# EAGLE design shield31 (EAGLE 5.02)
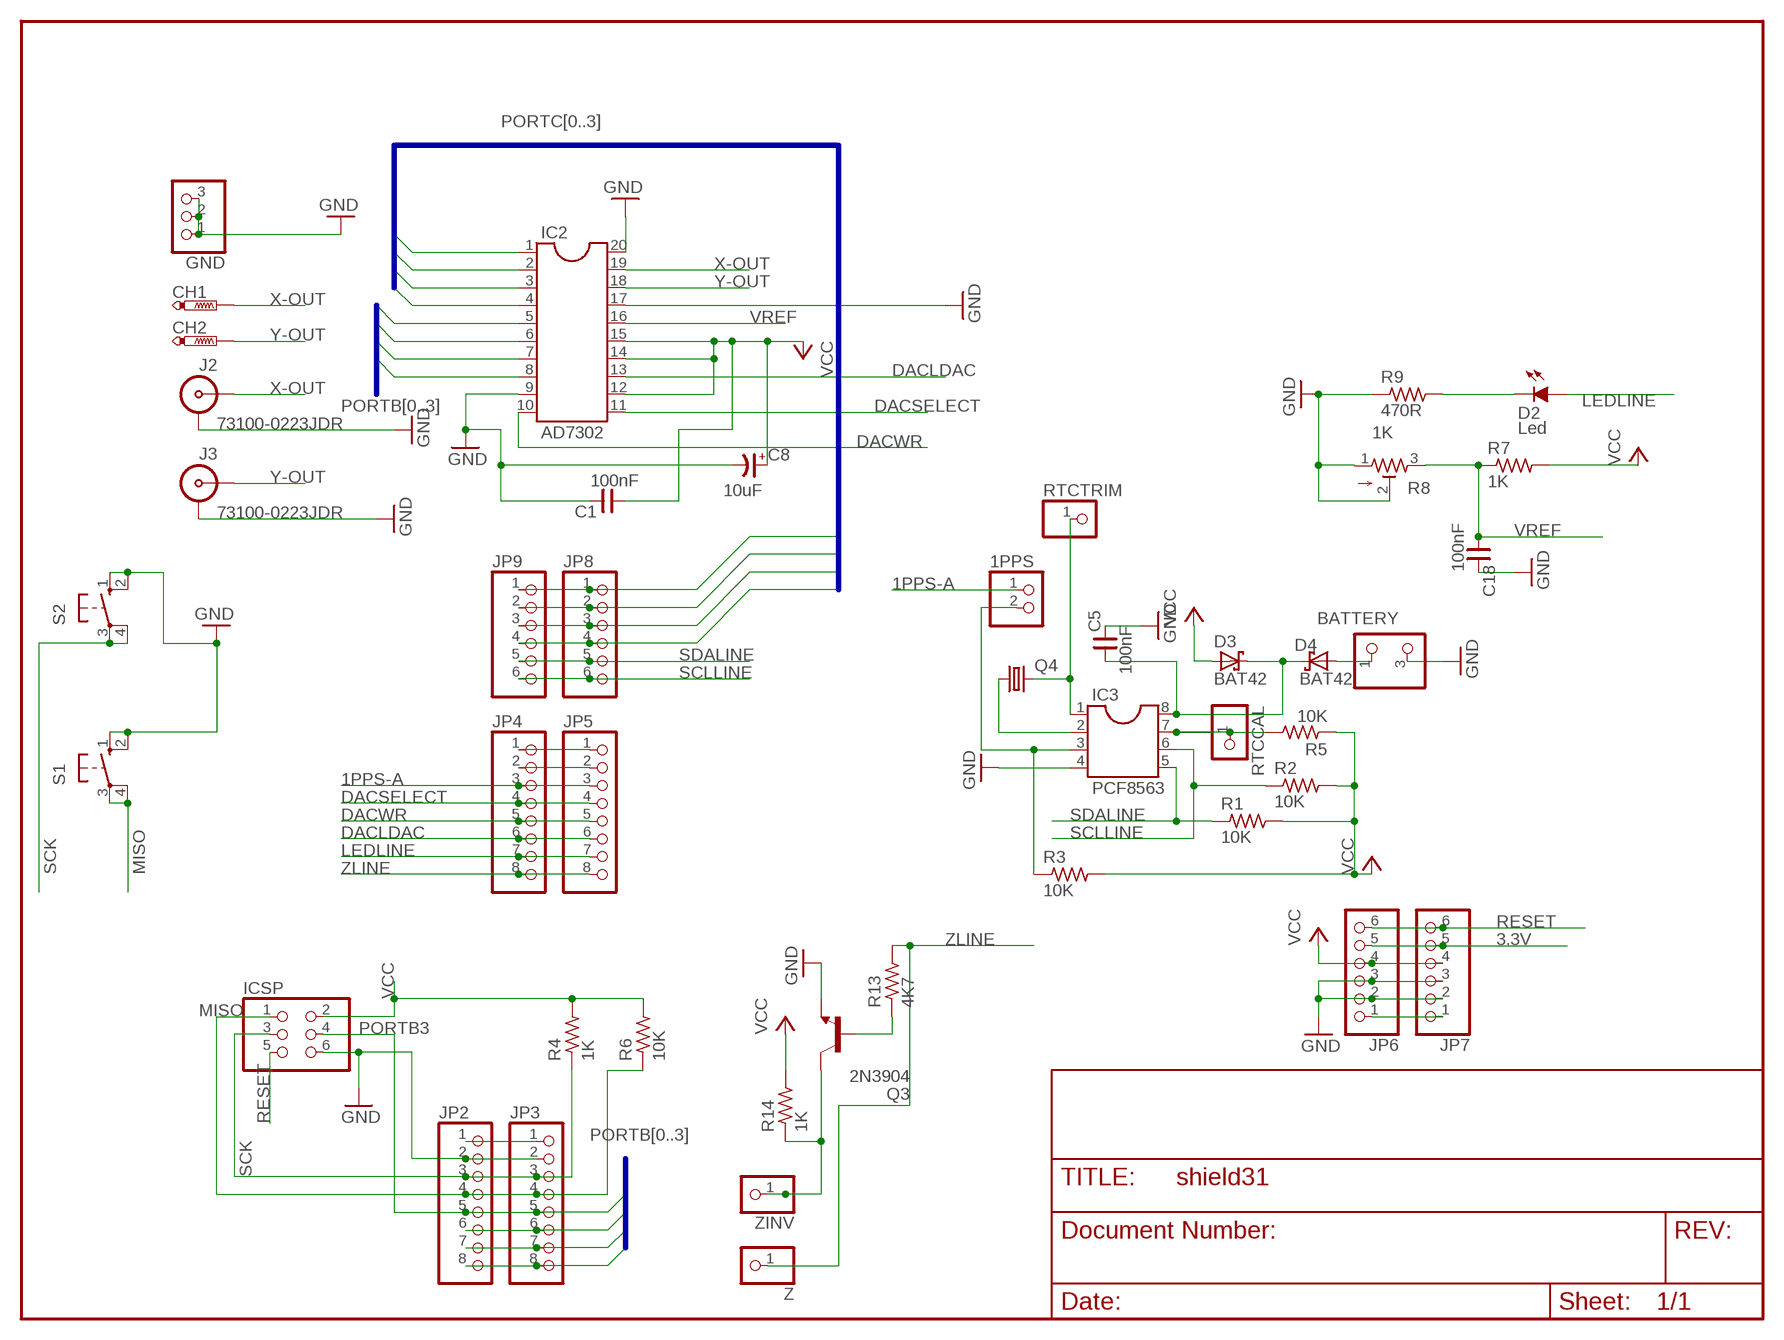
[diagram p0: schematic, sheet 1]

## Parts
1PPS  PINHD-1X2  [1X02]
BATTERY  PINHD-1X3BAT  [1X03BAT]
C1  100nF  C-EU025-025X050  [C025-025X050]
C5  100nF  C-EU025-025X050  [C025-025X050]
C8  10uF  CPOL-USE2.5-5  [E2,5-5]
C18  100nF  C-EU025-025X050  [C025-025X050]
CH1  PTR1PAD1-20Y  [P1-20Y]
CH2  PTR1PAD1-20Y  [P1-20Y]
D2  Led  LED3MM  [LED3MM]
D3  BAT42  SCHOTTKY-DIODEDO35-7  [DO35-7]
D4  BAT42  SCHOTTKY-DIODEDO35-7  [DO35-7]
GND  PINHD-1X3  [1X03]
IC2  AD7302  DIL20  [DIL20]
IC3  PCF8563  DIL8  [DIL08]
ICSP  PINHD-2X3  [2X03]
J2  73100-0223JDR  [73100-0223JDR]
J3  73100-0223JDR  [73100-0223JDR]
JP2  PINHD-1X8B  [1X08-BIG]
JP3  PINHD-1X8CLEANBIG  [1X08-CLEANBIG]
JP4  PINHD-1X8B  [1X08-BIG]
JP5  PINHD-1X8CLEANBIG  [1X08-CLEANBIG]
JP6  PINHD-1X6CB  [1X06-CLEANBIG]
JP7  PINHD-1X6B  [1X06-BIG]
JP8  PINHD-1X6CB  [1X06-CLEANBIG]
JP9  PINHD-1X6B  [1X06-BIG]
Q3  2N3904  [TO92]
Q4  CRYSTALTC26H  [TC26H]
R1  10K  R-EU_0207/10  [0207/10]
R2  10K  R-EU_0207/10  [0207/10]
R3  10K  R-EU_0207/10  [0207/10]
R4  1K  R-EU_0207/10  [0207/10]
R5  10K  R-EU_0207/10  [0207/10]
R6  10K  R-EU_0207/10  [0207/10]
R7  1K  R-EU_0207/10  [0207/10]
R8  1K  PIHER-POTV-PT10  [PT-10VERT]
R9  470R  R-EU_0207/10  [0207/10]
R13  4K7  R-EU_0207/10  [0207/10]
R14  1K  R-EU_0207/10  [0207/10]
RTCCAL  PINHD-1X1  [1X01]
RTCTRIM  PINHD-1X1  [1X01]
S1  10-XX  [B3F-10XX]
S2  10-XX  [B3F-10XX]
Z  PINHD-1X1  [1X01]
ZINV  PINHD-1X1  [1X01]

## Nets
1PPS-A: 1PPS.1 JP4.3 JP5.3
1PPS-B: 1PPS.2 IC3.3 R3.1
3.3V: JP6.5 JP7.5
BATPOWER: BATTERY.1 D4.A
DACLDAC: IC2.13 JP4.6 JP5.6
DACSELECT: IC2.11 JP4.4 JP5.4
DACWR: IC2.10 JP4.5 JP5.5
GND: BATTERY.3 C1.1 C5.1 C8.- C18.1 GND.1 GND.2 GND.3 IC2.9 IC2.17 IC2.20 IC3.4 ICSP.6 J2.GND J3.GND JP2.2 JP3.2 JP6.2 JP6.3 JP7.2 JP7.3 Q3.3(E) R8.1 R8.2 R9.1 S1.1(S) S1.2(S1) S2.1(S) S2.2(S1)
LEDLINE: D2.A JP4.7 JP5.7
MISO: ICSP.1 JP2.4 JP3.4 R6.1 S1.3(P) S1.4(P1)
N$1: IC3.7 R5.2 RTCCAL.1
N$2: JP2.1 JP3.1
N$3: D2.K(C) R9.2
N$13: IC3.1 Q4.2 RTCTRIM.1
N$14: IC3.2 Q4.1
N$15: JP6.1 JP7.1
N$26: Q3.2(B) R13.1
N$185: JP4.1 JP5.1
N$186: JP4.2 JP5.2
PORTB0: IC2.8 JP2.8 JP3.8
PORTB1: IC2.7 JP2.7 JP3.7
PORTB2: IC2.6 JP2.6 JP3.6
PORTB3: IC2.5 ICSP.4 JP2.5 JP3.5
PORTC0: IC2.4 JP8.1 JP9.1
PORTC1: IC2.3 JP8.2 JP9.2
PORTC2: IC2.2 JP8.3 JP9.3
PORTC3: IC2.1 JP8.4 JP9.4
RESET: ICSP.5 JP6.6 JP7.6
RTCPOWER: C5.2 D3.C D4.C IC3.8
SCK: ICSP.3 JP2.3 JP3.3 R4.1 S2.3(P) S2.4(P1)
SCLLINE: IC3.6 JP8.6 JP9.6 R2.1
SDALINE: IC3.5 JP8.5 JP9.5 R1.1
VCC: C1.2 C8.+ D3.A IC2.12 IC2.14 IC2.15 ICSP.2 JP6.4 JP7.4 R1.2 R2.2 R3.2 R4.2 R5.1 R6.2 R7.2 R14.2
VREF: C18.2 IC2.16 R7.1 R8.3
X-OUT: CH1.1(TP) IC2.19 J2.P
Y-OUT: CH2.1(TP) IC2.18 J3.P
ZINVLINE: Q3.1(C) R14.1 ZINV.1
ZLINE: JP4.8 JP5.8 R13.2 Z.1

## Buses
PORTC[0..3]
PORTB[0..3]

## Library data of the parts
1PPS = pinhead:PINHD-1X2: PIN HEADER
BATTERY = pinhead:PINHD-1X3BAT
C1 C5 C18 = rcl:C-EU: CAPACITOR, European symbol
C8 = rcl:CPOL-US: POLARIZED CAPACITOR, American symbol
CH1 CH2 = testpad:PTR1: TEST PIN
D2 = led:LED: LED OSRAM: - CHIPLED LG R971, LG N971, LY N971, LG Q971, LY Q971, LO R971, LY R971 LH N974, LH R974 LS Q976, LO Q976, LY Q976 LO Q996 - Hyper CHIPLED LW Q18S LB Q993, LB Q99A, LB R99A - SideLED LS A670, LO A670, LY A670, LG A670, LP A670 LB A673, LV A673, LT A673, LW A673 LH A674 LY A675 LS A676, LA A676, LO A676, LY A676, LW A676 LS A679, LY A679, LG A679 - Hyper Micro SIDELED® LS Y876, LA Y876, LO Y876, LY Y876 LT Y87S - SmartLED LW L88C, LW L88S LB L89C, LB L89S, LG L890 LS L89K, LO L89K, LY L89K LS L896, LA L896, LO L896, LY L896 - TOPLED LS T670, LO T670, LY T670, LG T670, LP T670 LSG T670, LSP T670, LSY T670, LOP T670, LYG T670 LG T671, LOG T671, LSG T671 LB T673, LV T673, LT T673, LW T673 LH T674 LS T676, LA T676, LO T676, LY T676, LB T676, LH T676, LSB T676, LW T676 LB T67C, LV T67C, LT T67C, LS T67K, LO T67K, LY T67K, LW E67C LS E67B, LA E67B, LO E67B, LY E67B, LB E67C, LV E67C, LT E67C LW T67C LS T679, LY T679, LG T679 LS T770, LO T770, LY T770, LG T770, LP T770 LB T773, LV T773, LT T773, LW T773 LH T774 LS E675, LA E675, LY E675, LS T675 LS T776, LA T776, LO T776, LY T776, LB T776 LHGB T686 LT T68C, LB T68C - Hyper Mini TOPLED® LB M676 - Mini TOPLED Santana® LG M470 LS M47K, LO M47K, LY M47K Source: http://www.osram.convergy.de/
D3 D4 = diode:SCHOTTKY-DIODE: Schottky Diode
GND = pinhead:PINHD-1X3: PIN HEADER
IC2 = ic-package:DIL20: Dual In Line / Socket
IC3 = ic-package:DIL8: Dual In Line / Socket
ICSP = pinhead:PINHD-2X3: PIN HEADER
J2 J3 = con-coax:73100-0223: BNC CONNECTOR - Molex RF Connector, 50 ohm
JP2-JP5 = carduino:PINHD-1X8: PIN HEADER
JP6-JP9 = carduino:PINHD-1X6: PIN HEADER
Q3 = transistor-npn:2N3904: NPN Transistor
Q4 = crystal:CRYSTAL: CRYSTAL
R1-R7 R9 R13 R14 = rcl:R-EU_: RESISTOR, European symbol
R8 = Jdr-Eagle:PIHER-POTV-: Piher vertical pot h2.5
RTCCAL RTCTRIM Z ZINV = pinhead:PINHD-1X1: PIN HEADER
S1 S2 = switch-omron:10-XX: OMRON SWITCH

## Board
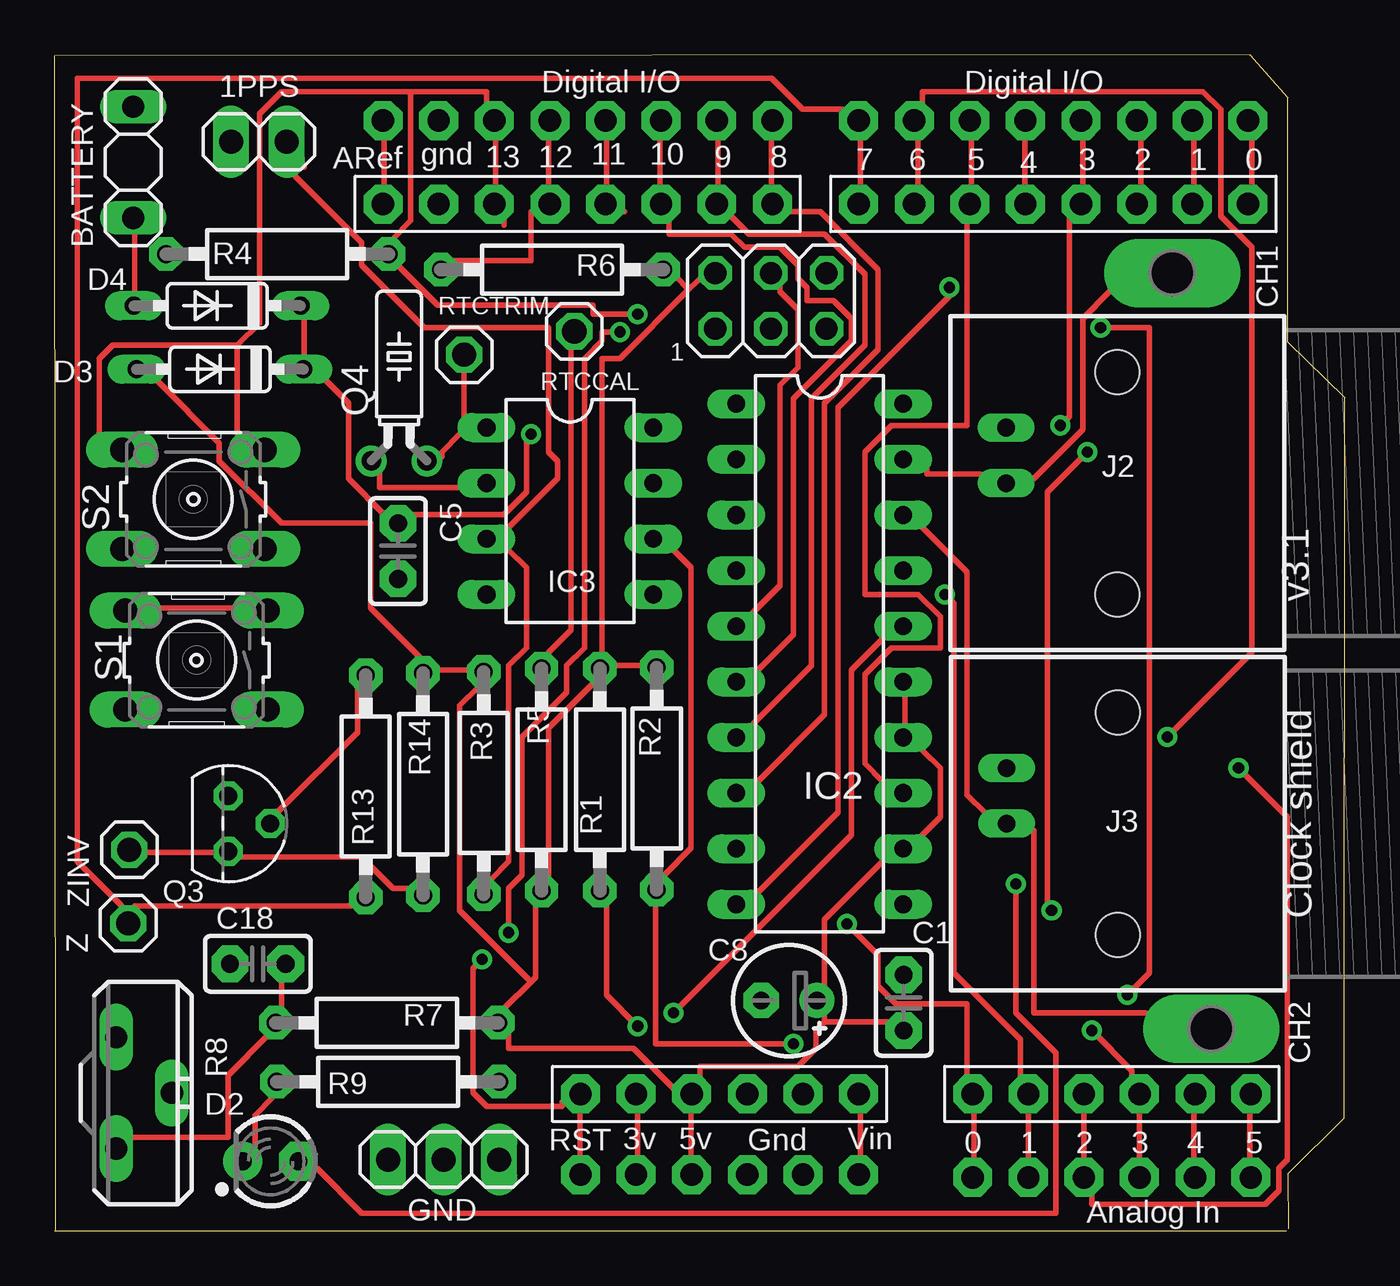
[diagram p1: board, top side]
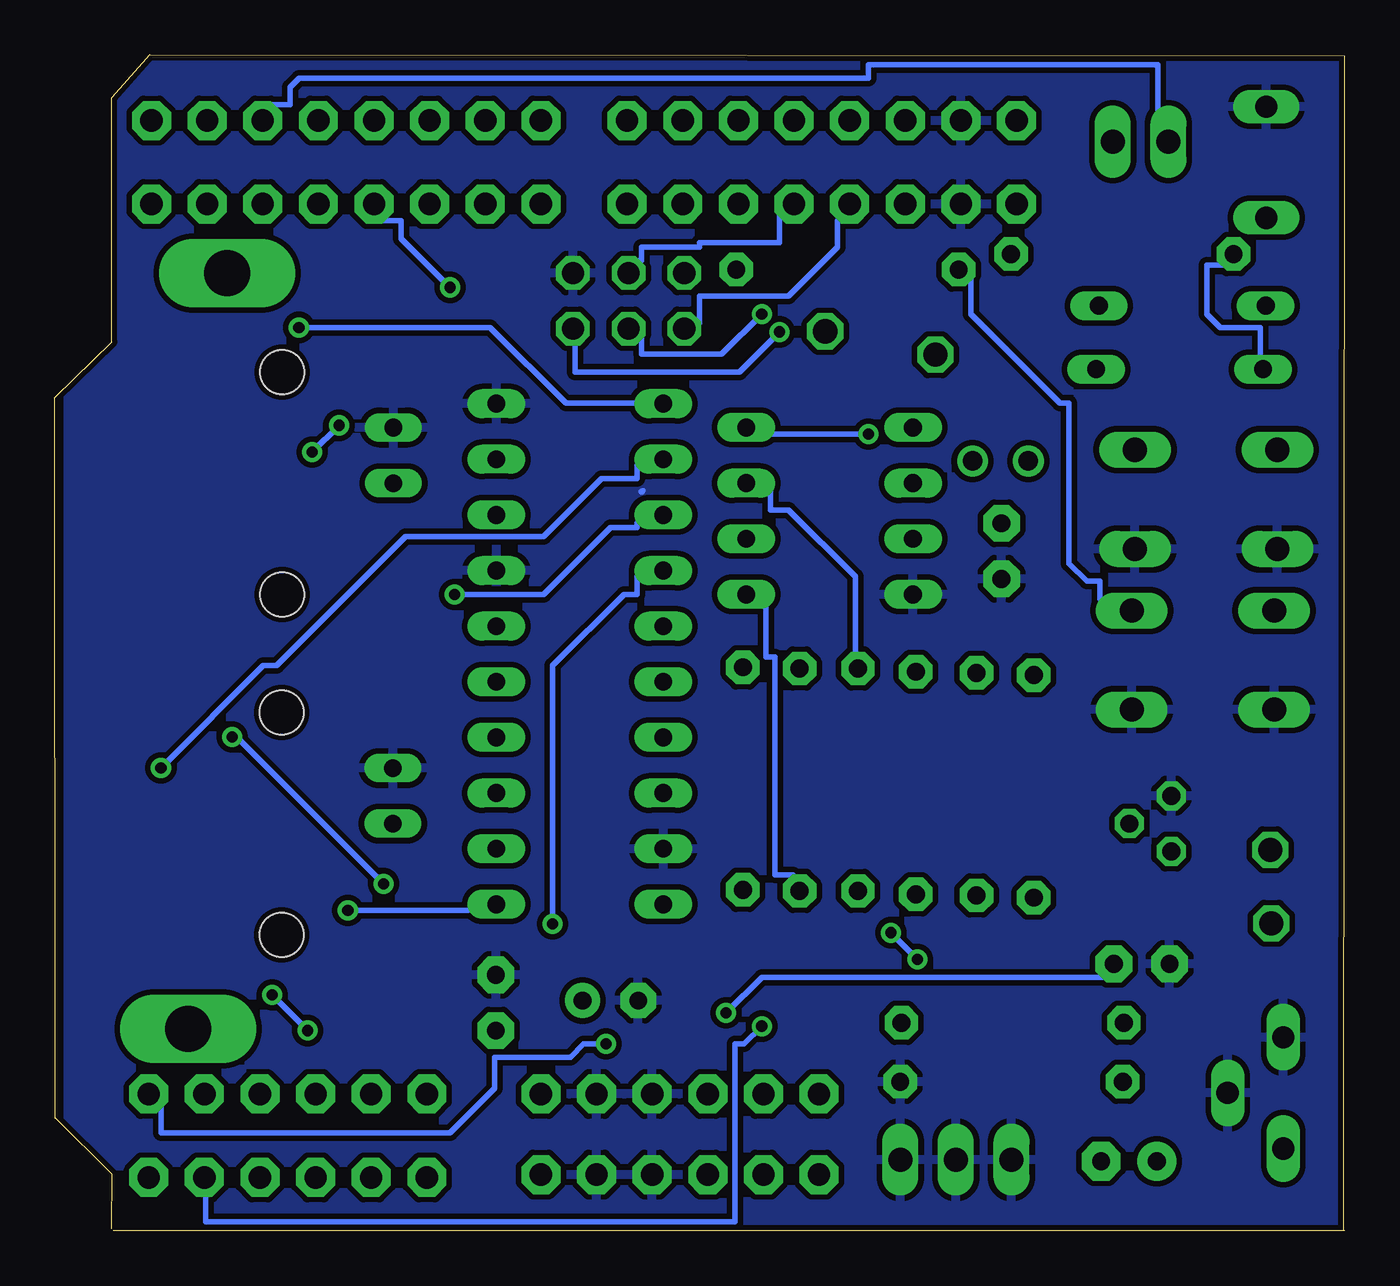
[diagram p2: board, bottom side, seen from below]

Size 58.9 x 53.71 mm. Coordinates in mm from the lower left corner, seen from the top.
Outline: 58.87,5.15 58.87,5.16
Outline: 58.87,5.16 58.9,38.05 56.3,40.59 56.3,51.73 54.57,53.71 0.01,53.66 0.05,0
Outline: 58.87,5.16 56.3,2.6 56.31,0.1
Outline: 0,0.01 56.24,0.01
Copper layers (1*16): Top 0.035mm / dielectric 1.5mm / Bottom 0.035mm
Design rules "default *": minimum track width 10mil, minimum drill 20mil, track to track 8mil, track to pad 8mil, pad to pad 8mil, via to via 8mil, smd to smd 8mil, copper to edge 10mil, drill to drill 8mil, minimum pad ring 10mil, minimum via ring 8mil, stop-mask expansion 4mil, vias tented up to drill 0mil, thermal gap 10mil

### Footprints (pad centres in the part's own frame; a part is rotated, then mirrored left to right if it is on the bottom)
1X02 = drill 1.1 long: 1 -1.27,0; 2 1.27,0
1X03BAT = drill 1.016 long: 1 -2.54,0; 3 2.54,0
C025-025X050 = drill 0.813 pad 1.676 octagon: 1 -1.27,0; 2 1.27,0
E2,5-5 = drill 0.813 pad 1.6 round: + -1.27,0 | drill 0.813 pad 1.6 octagon: - 1.27,0
P1-20Y = drill 2.1 pad 2.54 long: 1 0,0
LED3MM = drill 0.813 pad 1.778 octagon: A -1.27,0 | drill 0.813 pad 1.778 round: K 1.27,0
DO35-7 = drill 0.813 long: A 3.81,0; C -3.81,0
1X03 = drill 1.1 long: 1 -2.54,0; 2 0,0; 3 2.54,0
DIL20 = drill 0.813 long: 1 -11.43,-3.81; 2 -8.89,-3.81; 3 -6.35,-3.81; 4 -3.81,-3.81; 5 -1.27,-3.81; 6 1.27,-3.81; 7 3.81,-3.81; 8 6.35,-3.81; 9 8.89,-3.81; 10 11.43,-3.81; 11 11.43,3.81; 12 8.89,3.81; 13 6.35,3.81; 14 3.81,3.81; 15 1.27,3.81; 16 -1.27,3.81; 17 -3.81,3.81; 18 -6.35,3.81; 19 -8.89,3.81; 20 -11.43,3.81
DIL08 = drill 0.813 long: 1 -3.81,-3.81; 2 -1.27,-3.81; 3 1.27,-3.81; 4 3.81,-3.81; 5 3.81,3.81; 6 1.27,3.81; 7 -1.27,3.81; 8 -3.81,3.81
2X03 = drill 1.016 octagon: 1 -2.54,-1.27; 2 -2.54,1.27; 3 0,-1.27; 4 0,1.27; 5 2.54,-1.27; 6 2.54,1.27
73100-0223JDR = drill 0.8 long: GND 0,-2.54; P 0,0 | hole 2.007: -5.08,-5.08; -5.08,5.08
1X08-BIG = drill 1.016 pad 1.778 octagon: 1 -8.89,0; 2 -6.35,0; 3 -3.81,0; 4 -1.27,0; 5 1.27,0; 6 3.81,0; 7 6.35,0; 8 8.89,0
1X08-CLEANBIG = drill 1.016 pad 1.778 octagon: 1 -8.89,0; 2 -6.35,0; 3 -3.81,0; 4 -1.27,0; 5 1.27,0; 6 3.81,0; 7 6.35,0; 8 8.89,0
1X06-CLEANBIG = drill 1.016 pad 1.778 octagon: 1 -6.35,0; 2 -3.81,0; 3 -1.27,0; 4 1.27,0; 5 3.81,0; 6 6.35,0
1X06-BIG = drill 1.016 pad 1.778 octagon: 1 -6.35,0; 2 -3.81,0; 3 -1.27,0; 4 1.27,0; 5 3.81,0; 6 6.35,0
TO92 = drill 0.813 octagon: 1 1.27,0; 2 0,1.905; 3 -1.27,0
TC26H = drill 0.9 round: 1 -1.27,0; 2 1.27,0
0207/10 = drill 0.813 pad 1.524 octagon: 1 -5.08,0; 2 5.08,0
PT-10VERT = drill 1.016 long: 1 -2.54,-2.27; 2 0,0.27; 3 2.54,-2.27
1X01 = drill 1.1 octagon: 1 0,0
B3F-10XX = drill 1.1 long: 1 -3.251,2.261; 2 3.251,2.261; 3 -3.251,-2.261; 4 3.251,-2.261

### Placement (x,y rotation side)
1PPS  9.32,49.74 0 top
BATTERY  3.58,48.8 90 top
C1  38.76,10.42 270 top
C5  15.67,31.04 90 top
C8  33.53,10.52 180 top
C18  9.27,12.2 0 top
CH1  51.03,43.74 270 top
CH2  52.81,9.23 270 top
D2  9.86,3.18 180 top
D3  7.54,39.35 180 top
D4  7.42,42.25 180 top
GND  17.75,3.26 0 top
IC2  34.92,26.35 270 top
IC3  23.52,32.87 270 top
ICSP  32.7,42.47 0 top
J2  43.43,34.14 180 top
J3  43.46,18.6 180 top
JP2  23.88,46.89 0 top
JP3  23.88,50.7 0 top
JP4  45.59,46.89 180 top
JP5  45.59,50.7 180 top
JP6  30.35,2.57 180 top
JP7  30.35,6.25 180 top
JP8  48.26,2.44 0 top
JP9  48.26,6.25 0 top
Q3  7.92,18.6 270 top
Q4  15.72,35.16 0 top
R1  24.89,20.61 90 top
R2  27.48,20.66 90 top
R3  19.58,20.45 90 top
R4  10.16,44.61 180 top
R5  22.23,20.61 90 top
R6  22.71,43.9 0 top
R7  15.16,9.51 0 top
R8  5.08,6.3 270 top
R9  15.21,6.81 180 top
R13  14.2,20.3 270 top
R14  16.81,20.4 90 top
RTCCAL  23.72,41.08 0 top
RTCTRIM  18.69,40.01 0 top
S1  6.48,26.07 180 top
S2  6.32,33.41 180 top
Z  3.35,14.05 90 top
ZINV  3.4,17.4 90 top

### Tracks (layer width: path | path; a pad name or v marks a point on that pad's centre or on a via)
1PPS-A
  Top 0.254: JP4.3 49.58,47.76 49.58,49.99 JP5.3
  Bottom 0.254: 1PPS.1 8.53,51.21 8.53,53.24 21.74,53.24 21.74,52.63 47.75,52.63 48.16,52.23 48.16,51.42 48.97,51.42 JP5.3
1PPS-B
  Top 0.254: R3.1 19.91,16.06 20.73,16.87 20.73,25.81 21.54,26.62 21.54,30.28 20.73,31.1 IC3.3 20.73,32.11 22.96,34.35 22.96,35.16 22.55,35.57 22.55,41.26 16.87,41.26 14.02,44.1 14.02,45.12 10.97,48.16 1PPS.2 11.38,48.57
3.3V
  Top 0.254: JP6.5 26.62,3.26 26.62,5.49 JP7.5
BATPOWER
  Top 0.254: D4.A 3.66,42.88 3.66,45.52 BATTERY.1
DACLDAC
  Top 0.254: IC2.13 37.8,20.53 36.98,21.34 36.98,25.41 38.2,26.62 40.44,26.62 40.44,28.05 39.42,29.06 36.98,29.06 36.98,35.57 38.2,36.78 41.66,36.78 41.66,46.13 JP4.6 41.86,47.76 41.86,49.99 JP5.6
DACSELECT  (via drill 0.51)
  Top 0.254: v45.52,14.64 45.31,14.84 45.31,33.74 v47.14,35.57 | v45.92,36.78 46.33,37.19 46.33,46.34 JP4.4 46.94,47.76 46.94,49.99 JP5.4
  Bottom 0.254: v45.52,14.64 40.03,14.64 IC2.11 | v47.14,35.57 v45.92,36.78
DACWR  (via drill 0.51)
  Top 0.254: JP5.5 44.3,49.99 44.3,47.76 JP4.5 | v40.84,43.08 40.84,42.68 35.76,37.6 35.76,19.11 32.11,15.45 IC2.10
  Bottom 0.254: v40.84,43.08 43.08,45.32 43.08,46.13 43.89,46.13 JP4.5
GND
  Bottom 0.254: 32.12,33.76 32.11,33.74 32.03,33.8
  pour Bottom (isolate 0.254): 0,53.35 58.32,53.4 58.32,0.06 0,0.01
LEDLINE  (via drill 0.51)
  Top 0.254: JP4.7 39.42,47.76 39.42,49.99 JP5.7 39.62,51.42 39.62,52.02 52.43,52.02 53.24,51.21 53.24,46.34 54.66,44.91 54.66,26.42 v50.8,22.56 | v43.89,15.86 43.89,9.96 45.72,8.13 45.72,0.82 14.02,0.82 11.99,2.85 D2.A
  Bottom 0.254: v43.89,15.86 50.6,22.56 v50.8,22.56
MISO
  Top 0.254: S1.4 4.67,28.45 8.13,28.45 S1.3 | JP3.4 22.55,49.99 22.55,47.76 JP2.4 21.74,46.54 21.74,44.3 18.29,44.3 R6.1
  Bottom 0.254: ICSP.1 29.46,41.46 29.46,42.68 25.4,42.68 23.16,44.91 23.16,46.13 22.96,46.13 JP2.4 | S1.3 11.18,28.86 11.18,29.67 11.79,29.67 12.6,30.49 12.6,37.8 13.01,37.8 17.07,41.86 17.07,43.49 R6.1
N$1
  Top 0.254: RTCCAL.1 23.57,40.44 23.57,27.44 22.55,26.42 R5.2
  Bottom 0.254: IC3.7 26.21,33.74 26.21,32.92 25.4,32.92 22.35,29.88 22.35,26.42 R5.2
N$2
  Top 0.254: JP2.1 15.04,47.76 15.04,49.99 JP3.1
N$3
  Top 0.254: R9.2 9.96,6.1 9.14,5.29 9.14,3.87 D2.K
N$13
  Top 0.254: Q4.2 17.68,35.36 17.68,35.57 18.49,36.38 IC3.1 18.69,37.19 RTCTRIM.1
N$14
  Top 0.254: IC3.2 18.49,33.94 14.83,33.94 14.83,34.55 Q4.1
N$15
  Top 0.254: JP6.1 36.78,3.26 36.78,5.49 JP7.1
N$26
  Top 0.254: Q3.2 10.16,19.11 13.82,22.76 13.82,24.8 R13.1
N$185
  Top 0.254: JP4.1 54.66,47.76 54.66,49.99 JP5.1
N$186
  Top 0.254: JP4.2 52.02,47.76 52.02,49.99 JP5.2
PORTB0
  Top 0.254: IC2.8 32.11,20.53 35.15,23.58 35.15,37.8 37.59,40.24 37.59,43.9 34.95,46.54 33.53,46.54 JP2.8 32.72,47.76 32.72,49.99 JP3.8
PORTB1
  Top 0.254: IC2.7 31.9,23.17 34.54,25.81 34.54,38 36.98,40.44 36.98,43.69 35.15,45.52 31.7,45.52 30.89,46.34 JP2.7 30.28,47.76 30.28,49.99 JP3.7
PORTB2
  Top 0.254: IC2.6 32.11,25.61 33.73,27.23 33.73,38 36.37,40.65 36.37,41.66 35.56,42.47 34.34,42.47 34.34,43.08 33.93,43.49 33.93,44.1 33.12,44.91 31.5,44.91 30.89,45.52 28.04,45.52 28.04,46.13 JP2.6 27.64,47.76 27.64,49.99 JP3.6
PORTB3
  Top 0.254: JP3.5 25.2,49.99 25.2,47.76 JP2.5 26.01,46.54 | IC2.5 31.9,28.25 33.12,29.47 33.12,38.61 33.93,39.43 33.93,42.07 33.12,42.88 33.12,43.08 ICSP.4 32.11,43.49
  Bottom 0.254: JP2.5 25.81,46.34 25.81,45.12 29.46,45.12 29.46,44.91 32.11,44.91 32.11,44.3 32.31,44.3 ICSP.4
PORTC0  (via drill 0.51)
  Top 0.254: 41.96,2.44 41.96,2.39 | JP8.1 41.96,2.44 | 41.96,2.44 41.96,6.25 JP9.1 41.66,7.12 41.66,10.37 38.41,10.37 37.59,11.18 37.59,12.6 v36.17,14.03
  Bottom 0.254: v36.17,14.03 36.17,25.81 32.92,29.06 32.31,29.06 32.31,29.88 IC2.4
PORTC1  (via drill 0.51)
  Top 0.254: 44.45,2.39 JP8.2 JP9.2 44.09,7.12 44.09,8.74 41.05,11.79 41.05,28.66 v40.64,29.06
  Bottom 0.254: v40.64,29.06 36.58,29.06 33.53,32.11 32.31,32.11 32.31,32.31 IC2.3
PORTC2  (via drill 0.51)
  Top 0.254: JP8.3 46.99,2.34 | JP8.3 JP9.3 | v54.05,21.14 56.29,18.9 56.29,3.26 55.88,2.85 55.88,1.83 55.27,1.22 47.35,1.22 47.35,1.63 JP8.3
  Bottom 0.254: v54.05,21.14 49.38,25.81 48.77,25.81 42.88,31.7 36.58,31.7 33.93,34.35 32.31,34.35 32.31,34.96 IC2.2
PORTC3  (via drill 0.51)
  Top 0.254: 49.53,2.39 JP8.4 JP9.4 49.17,7.12 49.17,7.32 v47.35,9.15 | v47.75,41.26 49.99,41.26 49.99,11.79 v48.97,10.78
  Bottom 0.254: v47.75,41.26 39.01,41.26 35.56,37.8 32.31,37.8 IC2.1 | v47.35,9.15 v48.97,10.78
RESET  (via drill 0.51)
  Top 0.254: v25.81,41.05 24.99,41.05 24.99,40.65 24.18,39.83 24.18,26.62 23.37,25.81 23.37,24.59 21.34,22.56 21.34,16.26 20.73,15.65 v20.73,13.62 | v19.51,12.4 19.1,11.99 19.1,6.3 19.71,5.7 23.16,5.7 23.16,5.9 JP7.6 23.98,5.49 23.98,3.26 JP6.6
  Bottom 0.254: v25.81,41.05 27.64,39.22 35.15,39.22 35.15,40.44 ICSP.5 | v19.51,12.4 v20.73,13.62
RTCPOWER  (via drill 0.51)
  Top 0.254: D4.C 11.38,41.66 11.38,39.83 D3.C 12.39,38.82 13.41,37.8 13.41,34.35 15.04,32.72 C5.2 16.26,32.72 20.52,32.72 21.54,33.74 21.54,36.18 v21.74,36.38
  Bottom 0.254: v21.74,36.38 26.21,36.38 IC3.8
SCK  (via drill 0.51)
  Top 0.254: 8.33,40.44 2.64,40.44 2.03,39.83 2.03,36.38 S2.4 | 8.33,40.44 8.33,36.38 S2.3 | v26.62,41.86 24.59,41.86 24.59,42.27 17.48,42.27 15.65,44.1 R4.1 15.44,45.32 16.26,46.13 16.26,52.02 | 20.52,45.93 20.52,46.13 JP2.3 20.12,47.76 20.12,49.99 JP3.3 19.71,51.42 19.71,52.02 16.26,52.02 | 8.33,40.44 9.35,41.46 9.35,51.01 10.36,52.02 16.26,52.02
  Bottom 0.254: v26.62,41.86 28.45,40.04 32.11,40.04 32.11,40.85 ICSP.3
SCLLINE  (via drill 0.51)
  Top 0.254: 54.56,2.44 54.56,2.39 | 54.56,2.44 JP8.6 | JP9.6 54.56,6.25 54.56,2.44 | IC3.6 28.25,31.1 29.06,30.28 29.06,17.48 27.84,16.26 R2.1 27.43,14.84 27.43,8.54 v33.73,8.54
  Bottom 0.254: v33.73,8.54 34.75,8.54 35.36,7.93 38.81,7.93 38.81,6.51 40.84,4.48 54.05,4.48 54.05,5.7 JP9.6
SDALINE  (via drill 0.51)
  Top 0.254: JP8.5 52.02,2.44 52.02,6.25 JP9.5 | v26.62,9.35 25.2,10.78 25.2,14.84 R1.1
  Bottom 0.254: IC3.5 26.42,28.45 26.42,26.22 26.01,26.22 26.01,16.26 25.2,16.26 R1.1 | v26.62,9.35 27.43,8.54 27.84,8.54 27.84,0.41 52.02,0.41 52.02,1.63 JP8.5
VCC
  Top 0.254: D3.A 4.67,38.82 7.52,35.97 7.52,35.16 10.36,32.31 14.43,32.31 14.43,28.45 16.66,26.22 R14.2 17.48,25.61 18.9,25.61 R3.2 19.3,24.8 18.49,23.98 18.49,14.64 21.74,11.38 | R1.2 25.6,25.81 26.82,25.81 R2.2 | 28.85,42.88 25.81,39.83 24.99,39.83 24.99,26.42 R1.2 | 28.85,42.88 29.46,43.49 ICSP.2 | IC2.15 38.81,24.59 38.81,23.17 IC2.14 39.62,21.95 40.44,21.14 40.44,18.9 39.62,18.09 IC2.12 37.8,16.87 35.15,14.23 35.15,11.18 C8.+ 35.15,9.76 35.15,9.56 | 35.15,9.56 38,9.56 C1.2 | JP6.4 29.06,3.26 29.06,5.49 JP7.4 | 21.74,11.38 21.95,11.59 21.95,14.84 R5.1 22.55,16.26 22.55,22.97 24.59,25 R1.2 | 21.74,11.38 20.52,10.17 R7.2 20.73,8.95 20.73,8.34 26.42,8.34 28.25,6.51 JP7.4 | 35.15,9.56 34.75,9.15 34.75,8.34 33.93,7.52 29.46,7.52 29.46,7.12 JP7.4 | 28.85,42.88 28.85,43.08 28.45,43.49 R6.2
  Bottom 0.254: D3.A 3.86,39.83 3.86,41.26 5.69,41.26 6.3,41.86 6.3,44.1 5.49,44.1 R4.2
VREF  (via drill 0.51)
  Top 0.254: R8.3 3.45,4.27 7.92,4.27 7.92,7.12 9.75,8.95 R7.1 10.36,10.17 10.36,11.38 C18.2 | v28.25,9.96 36.37,18.09 36.37,25.61 37.8,27.03 IC2.16
  Bottom 0.254: v28.25,9.96 26.62,11.59 10.97,11.59 C18.2
X-OUT
  Top 0.254: IC2.19 39.83,34.75 39.83,34.55 42.27,34.55 J2.P 44.7,34.35 46.94,36.58 46.94,41.66 48.16,42.88 CH1.1
Y-OUT
  Top 0.254: IC2.18 39.62,32.11 41.66,30.08 41.66,19.92 42.47,19.11 J3.P 44.7,18.29 44.7,9.96 49.78,9.96 CH2.1
ZINVLINE
  Top 0.254: ZINV.1 4.06,17.28 7.32,17.28 Q3.1 8.53,17.07 14.02,17.07 15.44,15.65 16.26,15.65 R14.1
ZLINE
  Top 0.254: JP4.8 36.78,47.76 36.78,49.99 JP5.8 35.97,51.21 34.14,51.21 32.72,52.63 1.02,52.63 1.02,16.87 3.05,14.84 Z.1 3.66,14.84 13.61,14.84 R13.2

### Text on the board
tPlace: Digital I/O | Digital I/O | ARef | gnd | 13 | 12 | 11 | 10 | 9 | 8 | 7 | 6 | 5 | 4 | 3 | 2 | 1 | 0 | RST | 3v | 5v | Vin | Gnd | 0 | 1 | 2 | 3 | 4 | 5 | Analog In
tNames: 1 | v3.1 | Clock shield